# Altium schematic sheet 2013_CARTE_PUISSANCE.SchDoc
size A4
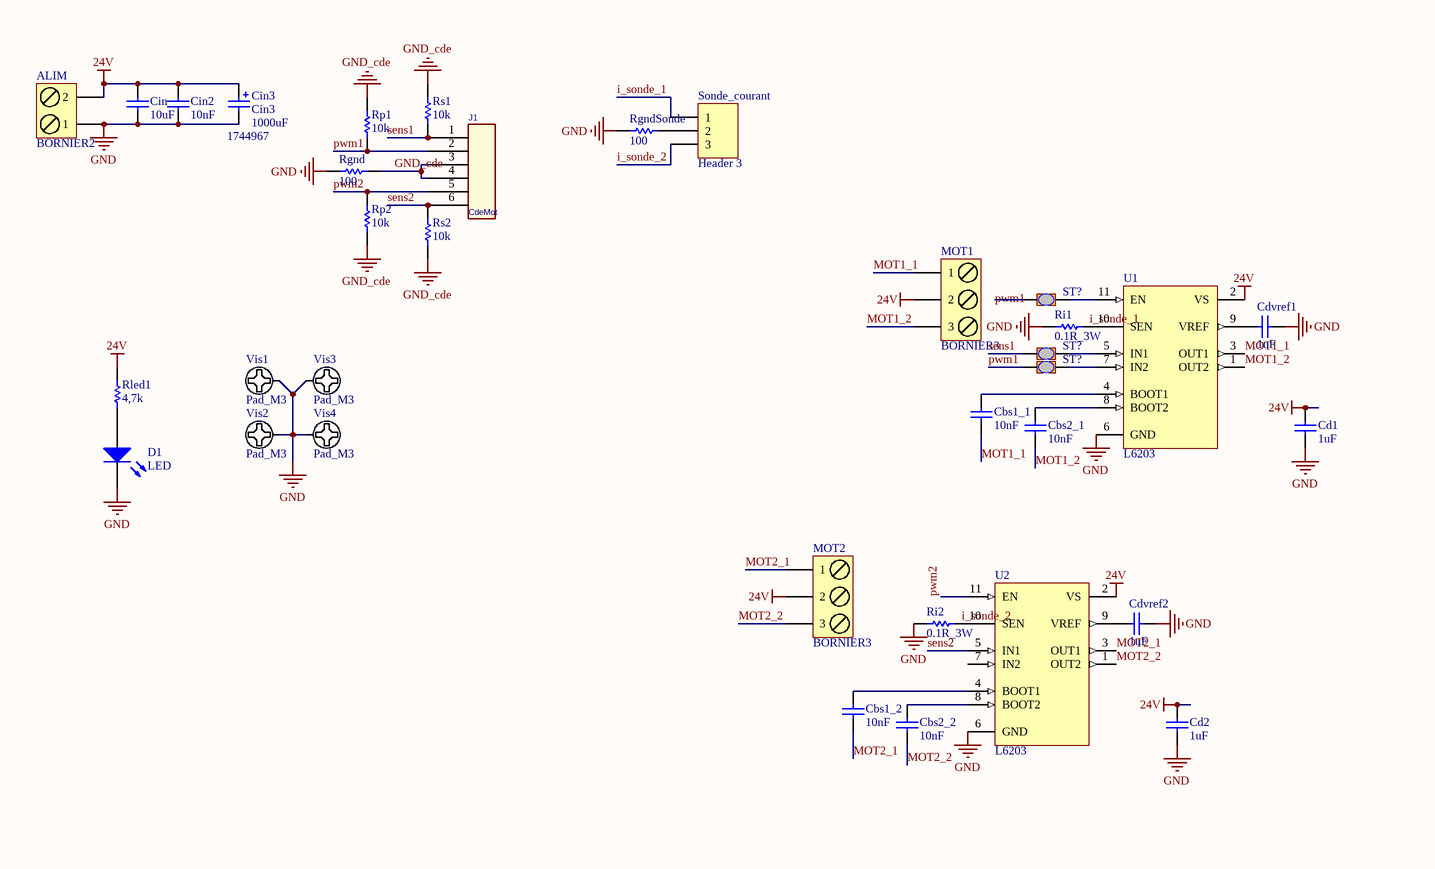
[diagram p0: 2013_CARTE_PUISSANCE.SchDoc, left]
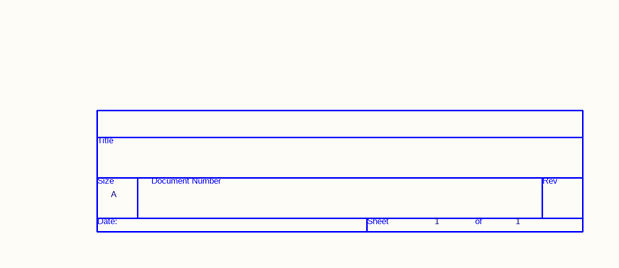
[diagram p1: 2013_CARTE_PUISSANCE.SchDoc, right]

## Parts
(Parts that share a designator on the sheet are numbered #1, #2 ... from top to bottom, then left to right.)
*  Page Count: 1  Page Size: A  (hidden comment: TitleBlock0)  (graphical)
ALIM  BORNIER2  [BORNIER2]
Cbs1_1  10nF  [C0805_N]
Cbs1_2  10nF  [C0805_N]
Cbs2_1  10nF  [C0805_N]
Cbs2_2  10nF  [C0805_N]
Cd1  1uF  [C1206_N]
Cd2  1uF  [C1206_N]
Cdvref1  1uF  [C1206_N]
Cdvref2  1uF  [C1206_N]
Cin  10uF  [C1206_N]
Cin2  10nF  [C0805_N]
Cin3  Cin3  value 1000uF  FAR: 1744967  [COND_POL_RAD_5.08B]
D1  LED  [LED_3mm]
J1  CdeMot  [RJ11_6/6]
MOT1  BORNIER3  [BORNIER3]
MOT2  BORNIER3  [BORNIER3]
Rgnd  100  [R1206_N]
RgndSonde  100  [R1206_N]
Ri1  0.1R_3W  [R1206_N]
Ri2  0.1R_3W  [R1206_N]
Rled1  4,7k  [R1206_N]
Rp1  10k  [R1206_N]
Rp2  10k  [R1206_N]
Rs1  10k  [R1206_N]
Rs2  10k  [R1206_N]
Sonde_courant  Header 3  [HDR1X3]
ST?#1  Goutte Strap_2  [Goutte Strap_2 Pads_Clearance 0.254mm]  (value not drawn)
ST?#2  Goutte Strap_2  [Goutte Strap_2 Pads_Clearance 0.254mm]  (value not drawn)
ST?#3  Goutte Strap_2  [Goutte Strap_2 Pads_Clearance 0.254mm]  (value not drawn)
U1  L6203  [Multiwatt11]
U2  L6203  [Multiwatt11]
Vis1  Pad_M3  [M3x6mm]
Vis2  Pad_M3  [M3x6mm]
Vis3  Pad_M3  [M3x6mm]
Vis4  Pad_M3  [M3x6mm]

## Nets
24V: ALIM.2 Cd1.1 Cd2.1 Cin.2 Cin2.2 Cin3.1 MOT1.2 MOT2.2 Rled1.2 U1.2(VS) U2.2(VS)
GND: ALIM.1 Cd1.2 Cd2.2 Cdvref1.2 Cdvref2.2 Cin.1 Cin2.1 Cin3.2 D1.2 Rgnd.2 RgndSonde.2 Ri1.1 Ri2.1 U1.6(GND) U2.6(GND) Vis1.1 Vis2.1 Vis3.1 Vis4.1
GND_cde: J1.3 J1.4 Rgnd.1 Rp1.2 Rp2.1 Rs1.2 Rs2.1
i_sonde_1: Sonde_courant.1
i_sonde_2: Sonde_courant.3
MOT1_1: Cbs1_1.1 MOT1.1 U1.3(OUT1)
MOT1_2: Cbs2_1.1 MOT1.3 U1.1(OUT2)
MOT2_1: Cbs1_2.1 MOT2.1 U2.3(OUT1)
MOT2_2: Cbs2_2.1 MOT2.3 U2.1(OUT2)
pwm1: J1.2 Rp1.1 ST?#3.1
pwm2: J1.5 Rp2.2 U2.11(EN)
sens1: J1.1 Rs1.1 ST?#2.1
sens2: J1.6 Rs2.2 U2.5(IN1)
NetCbs1_1_2: Cbs1_1.2 U1.4(BOOT1)
NetCbs1_2_2: Cbs1_2.2 U2.4(BOOT1)
NetCbs2_1_2: Cbs2_1.2 U1.8(BOOT2)
NetCbs2_2_2: Cbs2_2.2 U2.8(BOOT2)
NetCdvref1_1: Cdvref1.1 U1.9(VREF)
NetCdvref2_1: Cdvref2.1 U2.9(VREF)
NetD1_1: D1.1 Rled1.1
NetRgndSonde_1: RgndSonde.1 Sonde_courant.2
NetRi1_2: Ri1.2 U1.10(SEN)
NetRi2_2: Ri2.2 U2.10(SEN)
NetST?#1_2: ST?#1.2 U1.11(EN)
NetST?#2_2: ST?#2.2 U1.5(IN1)
NetST?#3_2: ST?#3.2 U1.7(IN2)

Not connected (* = marked no-connect by the designer): ST?#1 1; U2 7(IN2)

## Notes on the sheet
- Labels drawn without touching a wire or pin: i_sonde_1, i_sonde_2, pwm1
- (in symbol TitleBlock0) Title; Size; Document Number; Rev; Date:; Sheet; of

## Library data of the parts
ALIM = BORNIER2: Terminal blocks, 2 pins, pitch=5mm
Cbs1_1 Cbs1_2 Cbs2_1 Cbs2_2 Cd1 Cd2 Cdvref1 Cdvref2 Cin Cin2 = Capacitor: Published: 8-Jun-2000; LatestRevisionDate: 17-Jul-2002; LatestRevisionNote: Re-released for DXP Platform.; PackageReference: RAD-0.3; Publisher: Altium Limited
Cin3 = CONDENSATEUR_POLARISE: Polarized Capacitor; Published: 8-Jun-2000; LatestRevisionDate: 17-Jul-2002; LatestRevisionNote: Re-released for DXP Platform.; PackageReference: RB7.6-15; Publisher: Altium Limited
D1 = LED: Typical LED; Published: 8-Jun-2000; LatestRevisionDate: 08-Jul-2005; LatestRevisionNote: Mech Layer 1 removed.; PackageReference: LED-1; Publisher: Altium Limited
J1 = CONNECTEUR_RJ12
MOT1 MOT2 = BORNIER3: Terminal blocks, 2 pins, pitch=5mm
Rgnd RgndSonde Ri1 Ri2 Rled1 Rp1 Rp2 Rs1 Rs2 = Resistor: Published: 8-Jun-2000; LatestRevisionDate: 17-Jul-2002; LatestRevisionNote: Re-released for DXP Platform.; PackageReference: AXIAL-0.5; Publisher: Altium Limited
Sonde_courant = Header 3: Header, 3-Pin; LatestRevisionDate: 17-Jul-2002; LatestRevisionNote: Re-released for DXP Platform.; Publisher: Altium Limited
U1 U2 = L6203: DMOS Full Bridge Driver; Note: TAB connected to pin 6; Published: 8-Jun-2000; LatestRevisionDate: 17-Jul-2002; LatestRevisionNote: Re-released for DXP Platform.; DatasheetVersion: Jul-1997; PackageReference: Multiwatt11; Publisher: Altium Limited; PackageDescription: TO, Thru-Hole, Vertical, Heatsink Mounted; 11 Bent Staggered Leads; Pitch 1.7 mm; ComponentLink1Description: Manufacturer Link; ComponentLink1URL: http://www.st.com/; ComponentLink2Description: Datasheet; ComponentLink2URL: http://www.st.com/stonline/products/literature/ds/1373/l6201.pdf
Vis1-Vis4 = Vis M3 X 6mm _TORX_Tête 6mm: Publisher: Damien Guitton
* = TitleBlock0: Page Number: 1; Page Create Date: March  8, 1995
ST?#1-ST?#3 = Goutte Strap_2: LatestRevisionDate: 30/01/11; Publisher: Damien Guitton